# Altium schematic sheet Sheet1.SchDoc
size A3
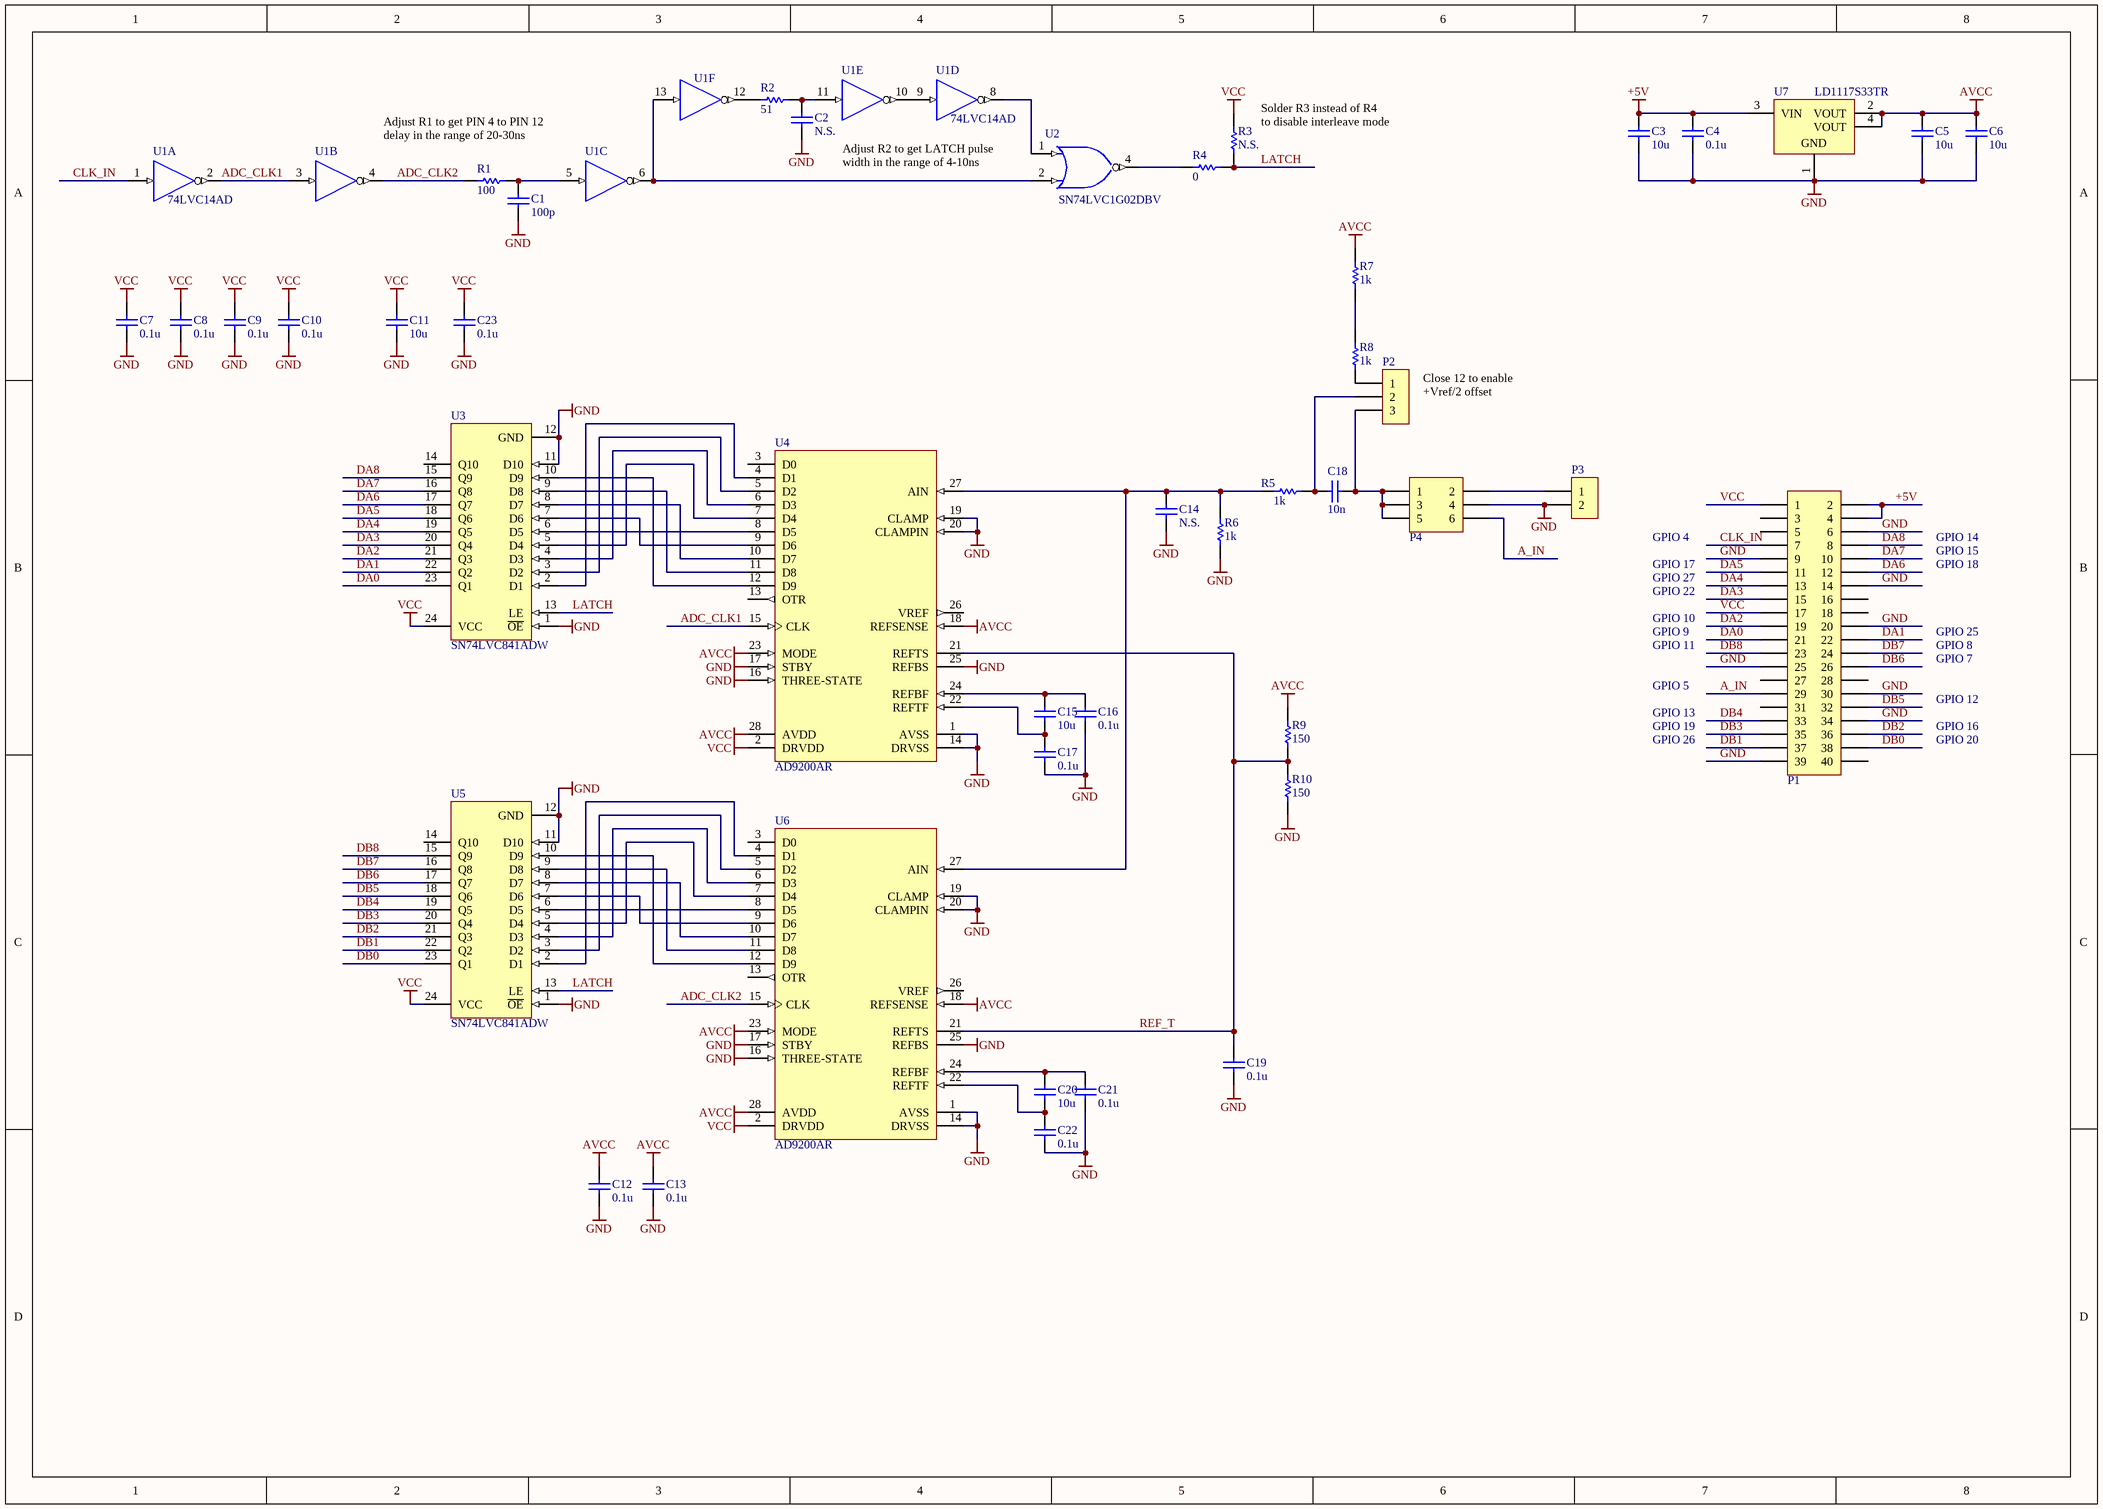
[diagram p0: Sheet1.SchDoc]

## Parts
C1  100p  [0805RC]
C2  N.S.  [0805RC]
C3  10u  [1206RC]
C4  0.1u  [0805RC]
C5  10u  [1206RC]
C6  10u  [1206RC]
C7  0.1u  [0805RC]
C8  0.1u  [0805RC]
C9  0.1u  [0805RC]
C10  0.1u  [0805RC]
C11  10u  [1206RC]
C12  0.1u  [0805RC]
C13  0.1u  [0805RC]
C14  N.S.  [0805RC]
C15  10u  [1206RC]
C16  0.1u  [0805RC]
C17  0.1u  [0805RC]
C18  10n  [0805RC]
C19  0.1u  [0805RC]
C20  10u  [1206RC]
C21  0.1u  [0805RC]
C22  0.1u  [0805RC]
C23  0.1u  [0805RC]
P1  Header 20X2  [PLD-40]  (value not drawn)
P2  PLS-3  [PLS-3]  (value not drawn)
P3  Header 2  [SCSL-2]  (value not drawn)
P4  Header 3X2  [PBD-6]  (value not drawn)
R1  100  [0805R]
R2  51  [0805R]
R3  N.S.  [0805R]
R4  0  [0805R]
R5  1k  [0805R]
R6  1k  [0805R]
R7  1k  [0805R]
R8  1k  [0805R]
R9  150  [0805R]
R10  150  [0805R]
U1  74LVC14AD  [M14A_N]  (parts A,B,C,D,E,F of 6)
U2  SN74LVC1G02DBV  [SOT-23-5L]
U3  SN74LVC841ADW  [DW024_N]
U4  AD9200AR  [RS-28_N]
U5  SN74LVC841ADW  [DW024_N]
U6  AD9200AR  [RS-28_N]
U7  LD1117S33TR  [SOT223-4N]

## Nets
+5V: C3.2 C4.2 P1.2 P1.4 U7.3(VIN)
AVCC: C5.2 C6.2 C12.2 C13.2 R7.2 R9.2 U4.18(REFSENSE) U4.23(MODE) U4.28(AVDD) U6.18(REFSENSE) U6.23(MODE) U6.28(AVDD) U7.2(VOUT) U7.4(VOUT)
GND: C1.1 C2.1 C3.1 C4.1 C5.1 C6.1 C7.1 C8.1 C9.1 C10.1 C11.1 C12.1 C13.1 C14.1 C16.2 C17.1 C19.1 C21.2 C22.1 C23.1 P1.6 P1.9 P1.14 P1.20 P1.25 P1.30 P1.34 P1.39 P3.2 P4.4 R6.1 R10.1 U1.7(GND) U2.3(GND) U3.1(~{OE}) U3.11(D10) U3.12(GND) U4.1(AVSS) U4.14(DRVSS) U4.16(THREE-STATE) U4.17(STBY) U4.19(CLAMP) U4.20(CLAMPIN) U4.25(REFBS) U5.1(~{OE}) U5.11(D10) U5.12(GND) U6.1(AVSS) U6.14(DRVSS) U6.16(THREE-STATE) U6.17(STBY) U6.19(CLAMP) U6.20(CLAMPIN) U6.25(REFBS) U7.1(GND)
VCC: C7.2 C8.2 C9.2 C10.2 C11.2 C23.2 P1.1 P1.17 R3.2 U1.14(VCC) U2.5(VCC) U3.24(VCC) U4.2(DRVDD) U5.24(VCC) U6.2(DRVDD)
A_IN: P1.29 P4.6
ADC_CLK1: U1.2(~{O}) U1.3(I) U4.15(CLK)
ADC_CLK2: R1.1 U1.4(~{O}) U6.15(CLK)
CLK_IN: P1.7 U1.1(I)
DA0: P1.21 U3.23(Q1)
DA1: P1.22 U3.22(Q2)
DA2: P1.19 U3.21(Q3)
DA3: P1.15 U3.20(Q4)
DA4: P1.13 U3.19(Q5)
DA5: P1.11 U3.18(Q6)
DA6: P1.12 U3.17(Q7)
DA7: P1.10 U3.16(Q8)
DA8: P1.8 U3.15(Q9)
DB0: P1.38 U5.23(Q1)
DB1: P1.37 U5.22(Q2)
DB2: P1.36 U5.21(Q3)
DB3: P1.35 U5.20(Q4)
DB4: P1.33 U5.19(Q5)
DB5: P1.32 U5.18(Q6)
DB6: P1.26 U5.17(Q7)
DB7: P1.24 U5.16(Q8)
DB8: P1.23 U5.15(Q9)
LATCH: R3.1 R4.2 U3.13(LE) U5.13(LE)
REF_T: C19.2 R9.1 R10.2 U4.21(REFTS) U6.21(REFTS)
NetC1_2: C1.2 R1.2 U1.5(I)
NetC2_2: C2.2 R2.2 U1.11(I)
NetC14_2: C14.2 R5.1 R6.2 U4.27(AIN) U6.27(AIN)
NetC15_1: C15.1 C17.2 U4.22(REFTF)
NetC15_2: C15.2 C16.1 U4.24(REFBF)
NetC18_1: C18.1 P2.3 P4.1 P4.3 P4.5
NetC18_2: C18.2 P2.2 R5.2
NetC20_1: C20.1 C22.2 U6.22(REFTF)
NetC20_2: C20.2 C21.1 U6.24(REFBF)
NetP2_1: P2.1 R8.2
NetP3_1: P3.1 P4.2
NetR2_1: R2.1 U1.12(~{O})
NetR4_1: R4.1 U2.4(Y)
NetR7_1: R7.1 R8.1
NetU1_6: U1.6(~{O}) U1.13(I) U2.2(B)
NetU1_8: U1.8(~{O}) U2.1(A)
NetU1_9: U1.9(I) U1.10(~{O})
NetU3_2: U3.2(D1) U4.4(D1)
NetU3_3: U3.3(D2) U4.5(D2)
NetU3_4: U3.4(D3) U4.6(D3)
NetU3_5: U3.5(D4) U4.7(D4)
NetU3_6: U3.6(D5) U4.8(D5)
NetU3_7: U3.7(D6) U4.9(D6)
NetU3_8: U3.8(D7) U4.10(D7)
NetU3_9: U3.9(D8) U4.11(D8)
NetU3_10: U3.10(D9) U4.12(D9)
NetU5_2: U5.2(D1) U6.4(D1)
NetU5_3: U5.3(D2) U6.5(D2)
NetU5_4: U5.4(D3) U6.6(D3)
NetU5_5: U5.5(D4) U6.7(D4)
NetU5_6: U5.6(D5) U6.8(D5)
NetU5_7: U5.7(D6) U6.9(D6)
NetU5_8: U5.8(D7) U6.10(D7)
NetU5_9: U5.9(D8) U6.11(D8)
NetU5_10: U5.10(D9) U6.12(D9)

Not connected (* = marked no-connect by the designer): P1 3 5 16 18 27 28 31 40; U3 14(Q10); U4 3(D0) 13(OTR) 26(VREF); U5 14(Q10); U6 3(D0) 13(OTR) 26(VREF)

## Notes on the sheet
- Adjust R1 to get PIN 4 to PIN 12
  delay in the range of 20-30ns
- (near U1) Adjust R2 to get LATCH pulse
  width in the range of 4-10ns
- (near R3) Solder R3 instead of R4
  to disable interleave mode
- (near P2) Close 12 to enable
  +Vref/2 offset
- GPIO 17
- GPIO 27
- GPIO 4
- GPIO 18
- GPIO 15
- GPIO 14
- GPIO 22
- GPIO 10
- GPIO 9
- GPIO 11
- GPIO 8
- GPIO 25
- GPIO 5
- GPIO 13
- GPIO 12
- GPIO 7
- GPIO 19
- GPIO 26
- GPIO 20
- GPIO 16

## Library data of the parts
C1-C23 = Cap: Capacitor; Published: 8-Jun-2000; LatestRevisionDate: 17-Jul-2002; LatestRevisionNote: Re-released for DXP Platform.; PackageReference: RAD-0.3; Publisher: Altium Limited
  C1: Value: 100p
  C2 C14: Value: N.S.
  C3 C5 C6 C11 C15 C20: Value: 10u
  C4 C7-C10 C12 C13 C16 C17 C19 C21-C23: Value: 0.1u
  C18: Value: 10n
P1 = Header 20X2: Header, 40-Pin; LatestRevisionDate: 17-Jul-2002; LatestRevisionNote: Re-released for DXP Platform.; Publisher: Altium Limited
P2 = Header 3: 3-pin general header; LatestRevisionDate: 17-Jul-2002; LatestRevisionNote: Re-released for DXP Platform.; Publisher: Altium Limited
P3 = Header 2: 2-pin general header; LatestRevisionDate: 17-Jul-2002; LatestRevisionNote: Re-released for DXP Platform.; Publisher: Altium Limited
P4 = Header 3X2: Header, 3-Pin, Dual row; LatestRevisionDate: 17-Jul-2002; LatestRevisionNote: Re-released for DXP Platform.; Publisher: Altium Limited
R1-R10 = Res1: Resistor; Published: 8-Jun-2000; LatestRevisionDate: 17-Jul-2002; LatestRevisionNote: Re-released for DXP Platform.; PackageReference: AXIAL-0.3; Publisher: Altium Limited
  R1: Value: 100
  R2: Value: 51
  R3: Value: N.S.
  R4: Value: 0
  R5-R8: Value: 1k
  R9 R10: Value: 150
U1 = 74ACT14SC: Hex Schmitt-Trigger Inverter, 14-Pin SOIC, Commercial Grade; IC_Technology: ACT; Published: 17-Jul-2002; LatestRevisionDate: 13-Apr-2006; LatestRevisionNote: IPC-7351 Footprint Added.; DatasheetVersion: Dec-1999; PackageVersion: 2000; PackageReference: M14A; Publisher: Altium Limited; PackageDescription: 14-Pin Small Outline Integrated Circuit 1.27 mm Pitch; Code_IPC: SOIC127P600-14; ComponentLink1Description: Manufacturer Link; ComponentLink1URL: http://www.fairchildsemi.com/; ComponentLink2Description: Datasheet; ComponentLink2URL: http://www.fairchildsemi.com/ds/74%2F74AC14.pdf
U3 U5 = SN74LVC841ADW: 10-Bit Bus-Interface D-Type Latch with 3-State Outputs; Published: 8-Jun-2000; LatestRevisionDate: 13-Apr-2006; LatestRevisionNote: IPC-7351 Footprint Added.; DatasheetVersion: Aug-1998; PackageVersion: Mar-2000; PackageReference: DW024; Publisher: Altium Limited; PackageDescription: 24-Pin Plastic Small Outline Integrated Circuit 1.27 mm Pitch; Code_JEDEC: MS-013; ComponentLink1Description: Manufacturer Link; ComponentLink1URL: http://www.ti.com/; ComponentLink2Description: Datasheet; ComponentLink2URL: http://www-s.ti.com/sc/ds/sn74lvc841a.pdf
U4 U6 = AD9200AR: Single 10-bit ADC Parallel 20MSPS; Part Number: AD9200; Manufacturer: Analog Devices; Resolution (Bits): 10; Channels: 1; Throughput Rate (SPS): 20M; Interface: Par; Packing: Tube; DatasheetVersion: Rev.E; PackageVersion: 060106-A; PackageReference: RS-28; PackageDescription: 28-Lead Shrink Small Outline Package [SSOP]; RoHS: N; Mounting Technology: Surface Mount; Code_JEDEC: MO-150-AH; ComponentLink1Description: Manufacturer URL; ComponentLink1URL: http://www.analog.com/en/index.html; ComponentLink2Description: Datasheet; ComponentLink2URL: http://www.analog.com/static/imported-files/data_sheets/AD9200.pdf; ComponentLink3Description: Package Specification; ComponentLink4Description: Product URL
U7 = LD1117S33TR: Fixed Low Drop Positive Voltage Regulator, 3.3V, 4-Pin SOT-223, Tape and Reel; DatasheetVersion: Nov-2011; PackageVersion: 2010; PackageReference: SOT-223; PackageDescription: 4-Pin SOT-223 Package, 6.5 x 3.5 mm Body, 2.3 mm Pitch, 7 mm Lead Span; PartNumber: LD1117S33TR; ComponentLink1Description: Manufacturer URL; ComponentLink1URL: http://www.st.com; ComponentLink2Description: Datasheet; ComponentLink2URL: http://www.st.com/internet/com/TECHNICAL_RESOURCES/TECHNICAL_LITERATURE/DATASHEET/CD00000544.pdf